# EAGLE schematic IotaWatt3.2 (EAGLE 8.1.1)
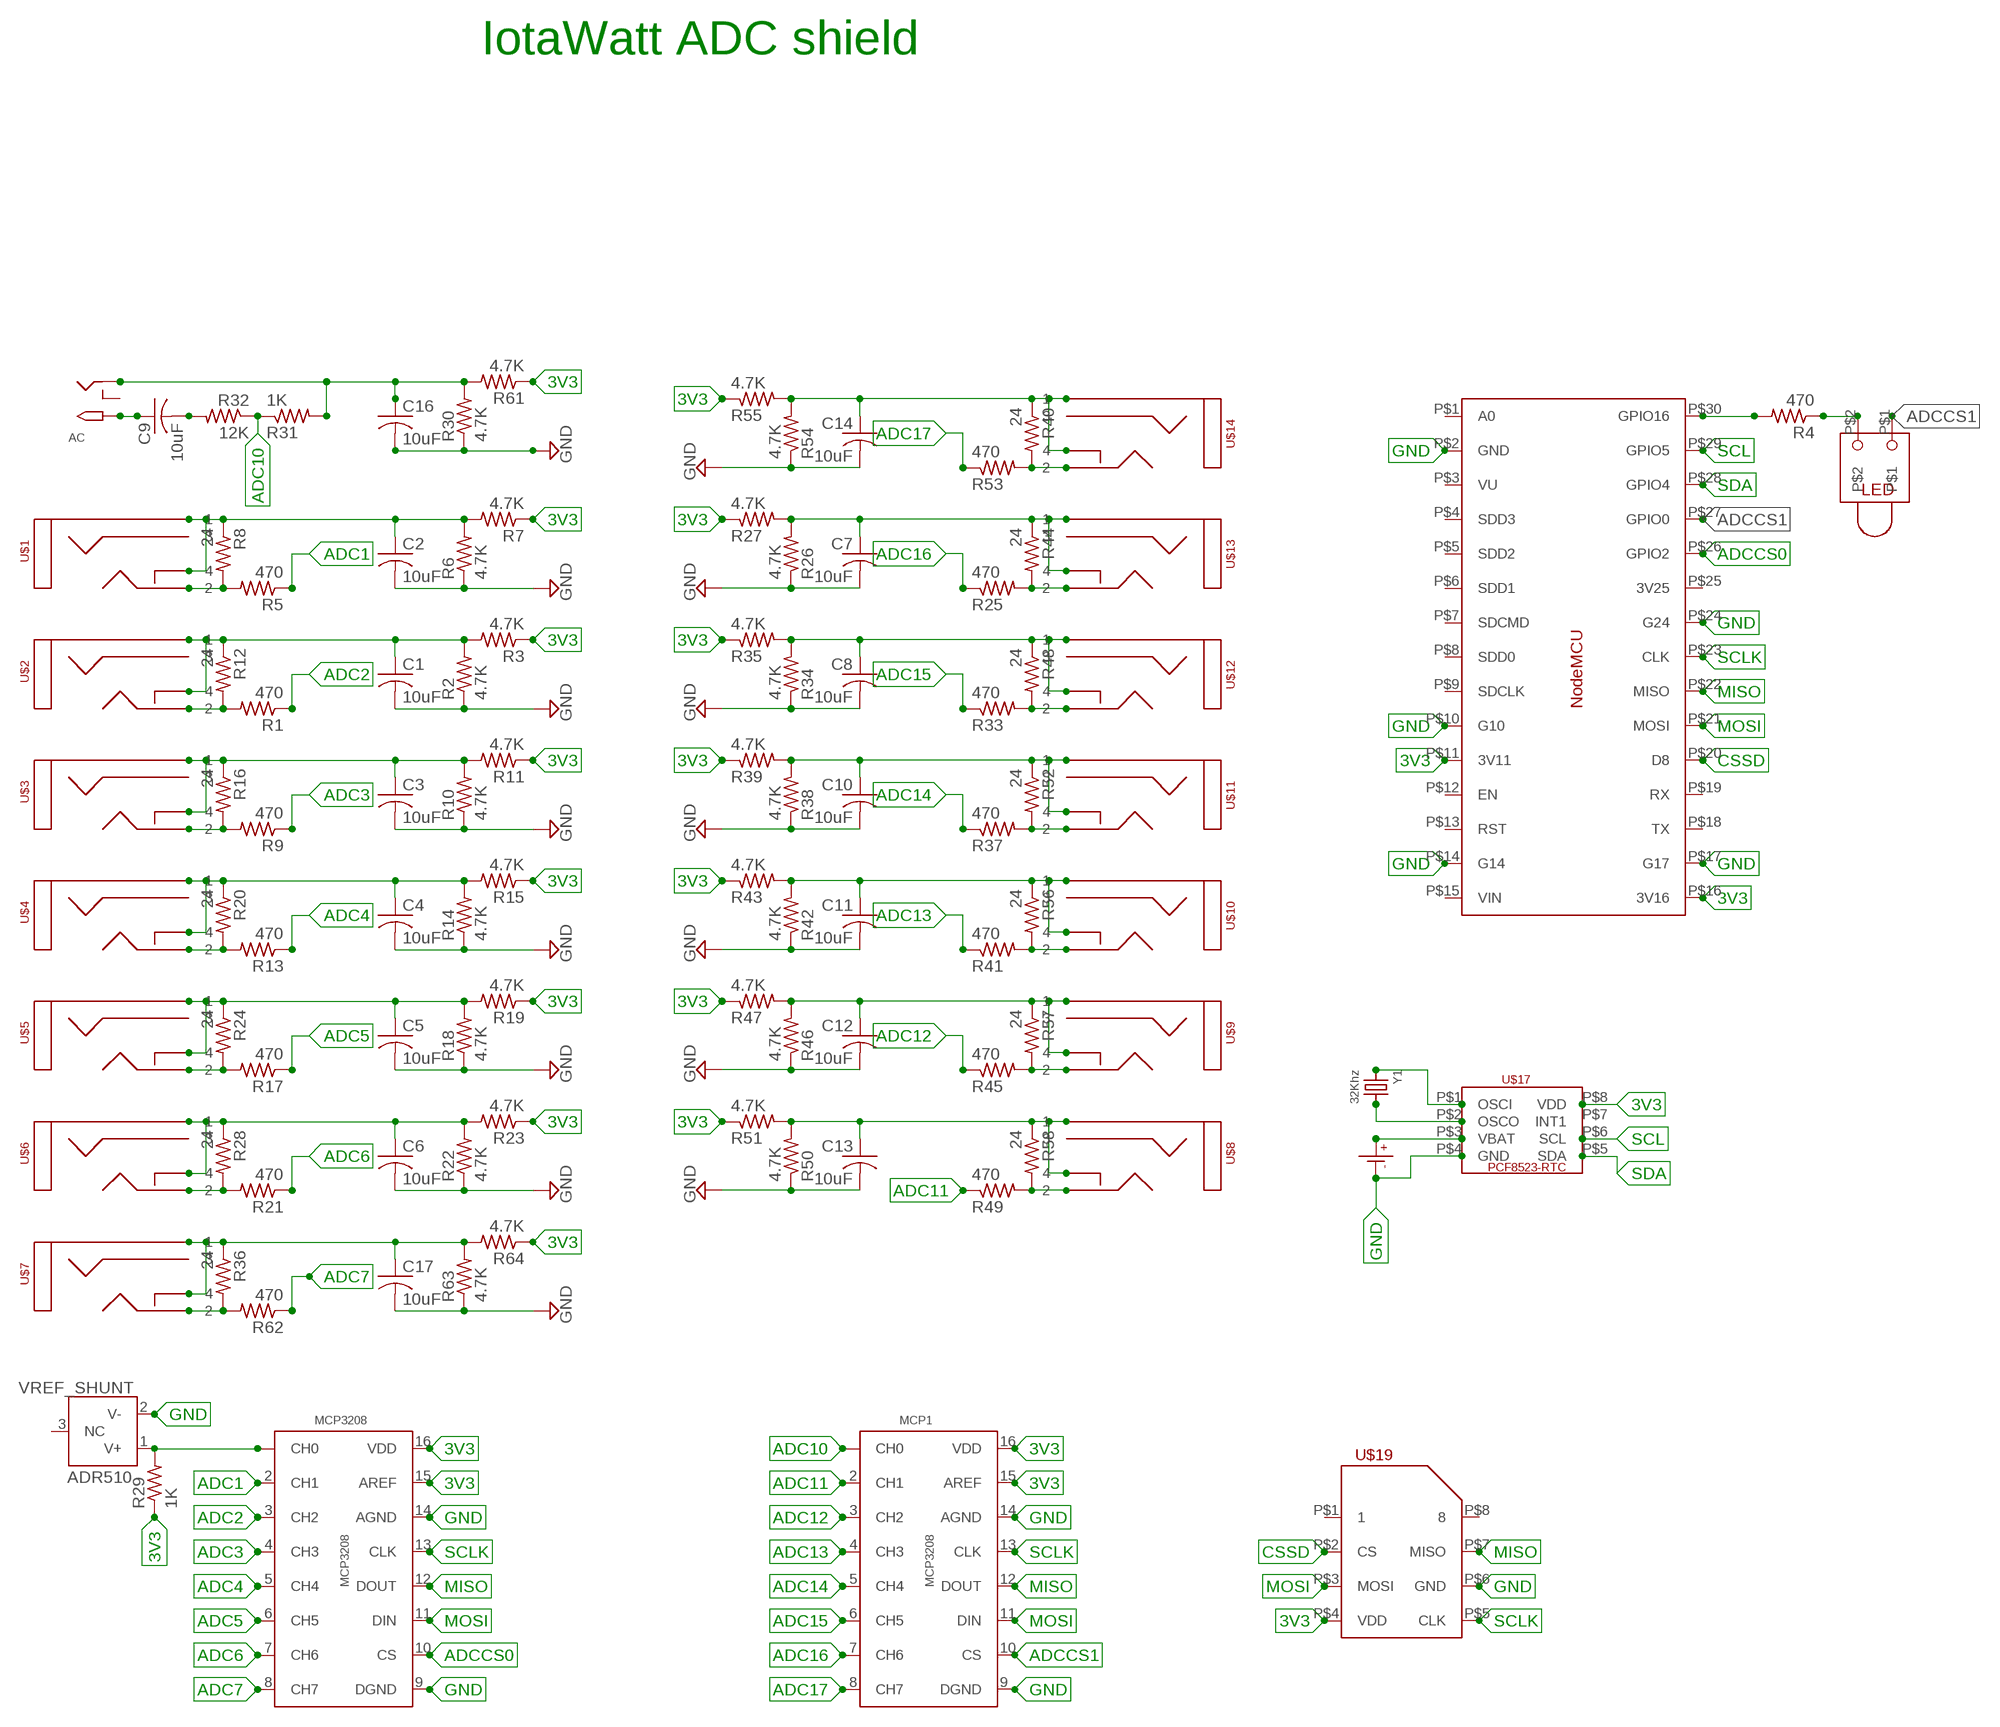
[diagram p0: schematic, sheet 1]

## Parts
AC  2.1MMJACKSMT  [DCJACK_2MM_SMT]
ADR510  VREF_SHUNT  [SOT23_3]
C1  10uF  C-USC0805  [C0805]
C2  10uF  C-USC0805  [C0805]
C3  10uF  C-USC0805  [C0805]
C4  10uF  C-USC0805  [C0805]
C5  10uF  C-USC0805  [C0805]
C6  10uF  C-USC0805  [C0805]
C7  10uF  C-USC0805  [C0805]
C8  10uF  C-USC0805  [C0805]
C9  10uF  C-USC0805  [C0805]
C10  10uF  C-USC0805  [C0805]
C11  10uF  C-USC0805  [C0805]
C12  10uF  C-USC0805  [C0805]
C13  10uF  C-USC0805  [C0805]
C14  10uF  C-USC0805  [C0805]
C16  10uF  C-USC0805  [C0805]
C17  10uF  C-USC0805  [C0805]
MCP1  MCP3208  [SOIC_16]
MCP3208  MCP3208  [SOIC_16]
R1  470  R-US_R0805  [R0805]
R2  4.7K  R-US_R0805  [R0805]
R3  4.7K  R-US_R0805  [R0805]
R4  470  R-US_R0805  [R0805]
R5  470  R-US_R0805  [R0805]
R6  4.7K  R-US_R0805  [R0805]
R7  4.7K  R-US_R0805  [R0805]
R8  24  R-US_R0805  [R0805]
R9  470  R-US_R0805  [R0805]
R10  4.7K  R-US_R0805  [R0805]
R11  4.7K  R-US_R0805  [R0805]
R12  24  R-US_R0805  [R0805]
R13  470  R-US_R0805  [R0805]
R14  4.7K  R-US_R0805  [R0805]
R15  4.7K  R-US_R0805  [R0805]
R16  24  R-US_R0805  [R0805]
R17  470  R-US_R0805  [R0805]
R18  4.7K  R-US_R0805  [R0805]
R19  4.7K  R-US_R0805  [R0805]
R20  24  R-US_R0805  [R0805]
R21  470  R-US_R0805  [R0805]
R22  4.7K  R-US_R0805  [R0805]
R23  4.7K  R-US_R0805  [R0805]
R24  24  R-US_R0805  [R0805]
R25  470  R-US_R0805  [R0805]
R26  4.7K  R-US_R0805  [R0805]
R27  4.7K  R-US_R0805  [R0805]
R28  24  R-US_R0805  [R0805]
R29  1K  R-US_R0805  [R0805]
R30  4.7K  R-US_R0805  [R0805]
R31  1K  R-US_R0805  [R0805]
R32  12K  R-US_R0805  [R0805]
R33  470  R-US_R0805  [R0805]
R34  4.7K  R-US_R0805  [R0805]
R35  4.7K  R-US_R0805  [R0805]
R36  24  R-US_R0805  [R0805]
R37  470  R-US_R0805  [R0805]
R38  4.7K  R-US_R0805  [R0805]
R39  4.7K  R-US_R0805  [R0805]
R40  24  R-US_R0805  [R0805]
R41  470  R-US_R0805  [R0805]
R42  4.7K  R-US_R0805  [R0805]
R43  4.7K  R-US_R0805  [R0805]
R44  24  R-US_R0805  [R0805]
R45  470  R-US_R0805  [R0805]
R46  4.7K  R-US_R0805  [R0805]
R47  4.7K  R-US_R0805  [R0805]
R48  24  R-US_R0805  [R0805]
R49  470  R-US_R0805  [R0805]
R50  4.7K  R-US_R0805  [R0805]
R51  4.7K  R-US_R0805  [R0805]
R52  24  R-US_R0805  [R0805]
R53  470  R-US_R0805  [R0805]
R54  4.7K  R-US_R0805  [R0805]
R55  4.7K  R-US_R0805  [R0805]
R56  24  R-US_R0805  [R0805]
R57  24  R-US_R0805  [R0805]
R58  24  R-US_R0805  [R0805]
R61  4.7K  R-US_R0805  [R0805]
R62  470  R-US_R0805  [R0805]
R63  4.7K  R-US_R0805  [R0805]
R64  4.7K  R-US_R0805  [R0805]
U$1  STEREO_SMD  [STEREO_SMT]
U$2  STEREO_SMD  [STEREO_SMT]
U$3  STEREO_SMD  [STEREO_SMT]
U$4  STEREO_SMD  [STEREO_SMT]
U$5  STEREO_SMD  [STEREO_SMT]
U$6  STEREO_SMD  [STEREO_SMT]
U$7  STEREO_SMD  [STEREO_SMT]
U$8  STEREO_SMD  [STEREO_SMT]
U$9  STEREO_SMD  [STEREO_SMT]
U$10  STEREO_SMD  [STEREO_SMT]
U$11  STEREO_SMD  [STEREO_SMT]
U$12  STEREO_SMD  [STEREO_SMT]
U$13  STEREO_SMD  [STEREO_SMT]
U$14  STEREO_SMD  [STEREO_SMT]
U$15  LED_RT_TRH  [LED_TH_RT]
U$16  NODEMCU  [NODEMCU]
U$17  PCF8523_RTC  [SOIC_8]
U$18  CR1220SMD  [CR1220SMD]
U$19  MICROSD_PUSH/PULL  [MICROSD]
Y1  32Khz  CRYSTAL8X3.8SMT  [CRYSTAL_8X3.8]

## Nets
3V3: MCP1.15(AREF) MCP1.16(VDD) MCP3208.15(AREF) MCP3208.16(VDD) R3.1 R7.1 R11.1 R15.1 R19.1 R23.1 R27.1 R29.1 R35.1 R39.1 R43.1 R47.1 R51.1 R55.1 R61.1 R64.1 U$16.P$11(3V11) U$16.P$16(3V16) U$17.P$8(VDD) U$19.P$4(VDD)
ADC0: ADR510.1(V+) MCP3208.1(CH0) R29.2
ADC1: MCP3208.2(CH1) R5.1
ADC2: MCP3208.3(CH2) R1.1
ADC3: MCP3208.4(CH3) R9.1
ADC4: MCP3208.5(CH4) R13.1
ADC5: MCP3208.6(CH5) R17.1
ADC6: MCP3208.7(CH6) R21.1
ADC7: MCP3208.8(CH7) R62.1
ADC10: MCP1.1(CH0) R31.1 R32.1
ADC11: MCP1.2(CH1) R49.1
ADC12: MCP1.3(CH2) R45.1
ADC13: MCP1.4(CH3) R41.1
ADC14: MCP1.5(CH4) R37.1
ADC15: MCP1.6(CH5) R33.1
ADC16: MCP1.7(CH6) R25.1
ADC17: MCP1.8(CH7) R53.1
ADCCS0: MCP3208.10(CS) U$16.P$26(GPIO2)
ADCCS1: MCP1.10(CS) U$15.P$1 U$16.P$27(GPIO0)
CSSD: U$16.P$20(D8) U$19.P$2(CS)
GND: ADR510.2(V-) C1.2 C2.2 C3.2 C4.2 C5.2 C6.2 C7.2 C8.2 C10.2 C11.2 C12.2 C13.2 C14.2 C16.2 C17.2 MCP1.9(DGND) MCP1.14(AGND) MCP3208.9(DGND) MCP3208.14(AGND) R2.1 R6.1 R10.1 R14.1 R18.1 R22.1 R26.1 R30.1 R34.1 R38.1 R42.1 R46.1 R50.1 R54.1 R63.1 U$16.P$2(GND) U$16.P$10(G10) U$16.P$14(G14) U$16.P$17(G17) U$16.P$24(G24) U$17.P$4(GND) U$18.P-(P$-) U$19.P$6(GND)
MISO: MCP1.12(DOUT) MCP3208.12(DOUT) U$16.P$22(MISO) U$19.P$7(MISO)
MOSI: MCP1.11(DIN) MCP3208.11(DIN) U$16.P$21(MOSI) U$19.P$3(MOSI)
N$1: R36.2 R62.2 U$7.P$2
N$2: R5.2 R8.2 U$1.P$2
N$3: R4.2 U$16.P$30(GPIO16)
N$4: C1.1 R2.2 R3.2 R12.1 U$2.P$1 U$2.P$4
N$5: C7.1 R26.2 R27.2 R44.1 U$13.P$1 U$13.P$4
N$6: C3.1 R10.2 R11.2 R16.1 U$3.P$1 U$3.P$4
N$7: C2.1 R6.2 R7.2 R8.1 U$1.P$1 U$1.P$4
N$8: R4.1 U$15.P$2
N$9: C4.1 R14.2 R15.2 R20.1 U$4.P$1 U$4.P$4
N$10: R1.2 R12.2 U$2.P$2
N$11: C12.1 R46.2 R47.2 R57.1 U$9.P$1 U$9.P$4
N$12: C5.1 R18.2 R19.2 R24.1 U$5.P$1 U$5.P$4
N$13: C17.1 R36.1 R63.2 R64.2 U$7.P$1 U$7.P$4
N$14: C6.1 R22.2 R23.2 R28.1 U$6.P$1 U$6.P$4
N$15: R9.2 R16.2 U$3.P$2
N$16: R25.2 R44.2 U$13.P$2
N$17: C9.2 R32.2
N$19: R33.2 R48.2 U$12.P$2
N$21: C13.1 R50.2 R51.2 R58.1 U$8.P$1 U$8.P$4
N$22: R37.2 R52.2 U$11.P$2
N$23: R13.2 R20.2 U$4.P$2
N$24: C10.1 R38.2 R39.2 R52.1 U$11.P$1 U$11.P$4
N$25: R17.2 R24.2 U$5.P$2
N$26: R41.2 R56.2 U$10.P$2
N$27: AC.PWR2(TIP) C9.1
N$28: R21.2 R28.2 U$6.P$2
N$30: C11.1 R42.2 R43.2 R56.1 U$10.P$1 U$10.P$4
N$31: R45.2 R57.2 U$9.P$2
N$33: R49.2 R58.2 U$8.P$2
N$34: C8.1 R34.2 R35.2 R48.1 U$12.P$1 U$12.P$4
N$35: R40.2 R53.2 U$14.P$2
N$36: C14.1 R40.1 R54.2 R55.2 U$14.P$1 U$14.P$4
N$43: U$17.P$3(VBAT) U$18.P+(P$+)
N$44: U$17.P$2(OSCO) Y1.P$4
N$45: U$17.P$1(OSCI) Y1.P$1
N$58: AC.GND(RING) C16.1 R30.2 R31.2 R61.2
SCL: U$16.P$29(GPIO5) U$17.P$6(SCL)
SCLK: MCP1.13(CLK) MCP3208.13(CLK) U$16.P$23(CLK) U$19.P$5(CLK)
SDA: U$16.P$28(GPIO4) U$17.P$5(SDA)
Unconnected: AC.GNDBREAK(RING_SW) ADR510.3(NC) U$1.P$3 U$2.P$3 U$3.P$3 U$4.P$3 U$5.P$3 U$6.P$3 U$7.P$3 U$8.P$3 U$9.P$3 U$10.P$3 U$11.P$3 U$12.P$3 U$13.P$3 U$14.P$3 U$16.P$1(A0) U$16.P$3(VU) U$16.P$4(SDD3) U$16.P$5(SDD2) U$16.P$6(SDD1) U$16.P$7(SDCMD) U$16.P$8(SDD0) U$16.P$9(SDCLK) U$16.P$12(EN) U$16.P$13(RST) U$16.P$15(VIN) U$16.P$18(TX) U$16.P$19(RX) U$16.P$25(3V25) U$17.P$7(INT1) U$19.P$1 U$19.P$8

## Notes on the sheet
- IotaWatt ADC shield

## Library data of the parts
AC = IotaWatt_parts:2.1MMJACK: 2.1mm x 5.5mm THM DC jack with internal switch. Digikey part #PJ-102A, 4UCON part #05537 2.1mm x 5.5mm SMT DC jack with internal switch. Digikey part #PJ-002A-SMT, 4UCON part #03267 By microbuilder.eu & adafruit.com
ADR510 = IotaWatt_parts:VREF_SHUNT: Voltage Reference Shunt - SOT23-3 (ADR504, etc.)
C1-C14 C16 C17 = adafruit:C-US: CAPACITOR, American symbol
MCP1 MCP3208 = IotaWatt_parts:MCP3208: MCP3208 12bit SPI ADC
R1-R58 R61-R64 = adafruit:R-US_: RESISTOR, American symbol
U$1-U$14 = IotaWatt_parts:STEREO_SMD: 3.5mm Stereo Jack SMT
U$15 = IotaWatt_parts:LED_RT_TRH: LED RT ThruHole BiColor Digikey 67-2237-ND
U$16 = IotaWatt_parts:NODEMCU: NodeMCU 1.0 ESP8266
U$17 = IotaWatt_parts:PCF8523_RTC: PCF8523-RTC SOIC-8
U$18 = IotaWatt_parts:CR1220SMD: CR1220 Battery SMD
U$19 = IotaWatt_parts:MICROSD_PUSH/PULL: McroSD Amphenol push/pull
Y1 = microbuilder:CRYSTAL: Crystals HC49UP - Surface Mount Crystal 4.0MHz 18pF +/-30ppm Surface Mount Crystal [Digikey: 535-9857-1-ND] 12.0 MHz Surface Mount Crystal [Digikey: 535-9869-6-ND] 25.0 MHz Surface Mount Crystal [Digikey: 535-9078-1-ND] 2.5 x 2.0mm - MEMs SMT Crystal 16.0 MHz 10pF 20ppm 2.5 x 2.0mm Crystal [Digikey -40-85°C: 535-10923-1-ND] 3.2 x 2.5mm - MEMs SMT Crystal 12.0 MHz 8pF 15ppm 3.2 x 2.5mm Crystal [Digikey: -10-70°C: 644-1047-1-ND -40-125°C: 644-1128-1-ND] 16.0 MHz 8pF 15ppm 3.2 x 2.5mm Crystal [Digikey: -10-70°C: 644-1049-1-ND -40-125°C: 644-1129-2-ND] 16.0 MHz 10pF 10ppm 3.2 x 2.5mm Crystal [Digikey: 644-1100-1-ND] 27.12 MHz 18pF 30ppm 3.2 x 2.5mm Crystal [Digikey: 887-1424-1-ND] 27.12MHz 10pF 10ppm 3.2 x 2.5mm Crystal [Digikey: 887-1329-1-ND] 4.9 x 1.8mm - MEMs SMT Crystal 32.768 KHz 12.5pF 20ppm 4.9 x 1.8mm Crystal [Digikey: SE2415CT-ND] 8.0 x 3.8mm - Surface Mount Crystal 32.768kHz 12.5pF 20ppm -40°C-85°C [Digikey: 535-9166-2-ND] Cylinder 32.768KHz Cylinder Crystal (2x6mm body) [Ex. Digikey: 300-8341-2-ND]